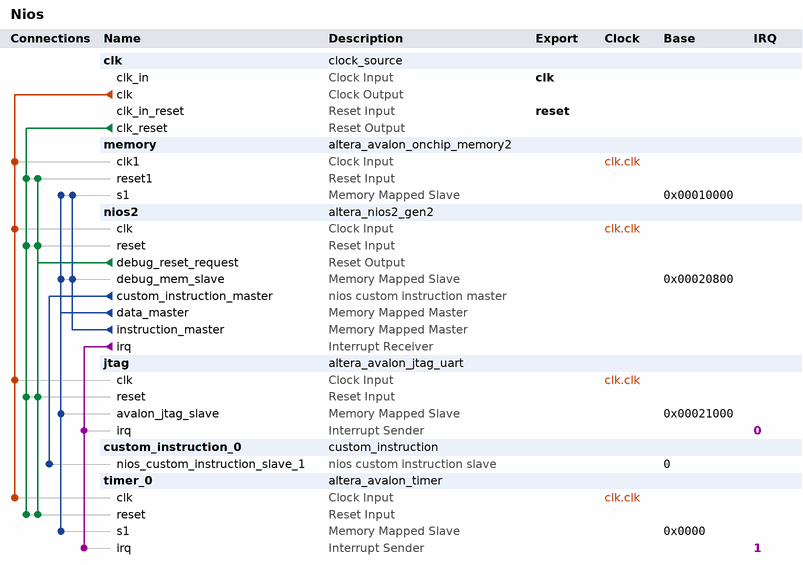
[diagram p0: system contents]
# Platform Designer (Qsys) system Nios, Cyclone V 5CSEMA5F31C6
# Parameters at their usual value, and those the tool derives, are not listed.
package require -exact qsys 18.1
create_system Nios
set_project_property DEVICE_FAMILY {Cyclone V}
set_project_property DEVICE 5CSEMA5F31C6

add_instance clk clock_source 18.1
set_instance_parameter_value clk clockFrequency 50000000

add_instance memory altera_avalon_onchip_memory2 18.1
set_instance_parameter_value memory dataWidth 32
set_instance_parameter_value memory dualPort false
set_instance_parameter_value memory initMemContent true
set_instance_parameter_value memory initializationFileName onchip_mem.hex
set_instance_parameter_value memory memorySize 40096

add_instance nios2 altera_nios2_gen2 18.1
set_instance_parameter_value nios2 dcache_size 2048
set_instance_parameter_value nios2 exceptionSlave memory.s1
set_instance_parameter_value nios2 icache_size 4096
set_instance_parameter_value nios2 impl Fast
set_instance_parameter_value nios2 resetSlave memory.s1

add_instance jtag altera_avalon_jtag_uart 18.1
set_instance_parameter_value jtag simInteractiveOptions NO_INTERACTIVE_WINDOWS

add_instance custom_instruction_0 custom_instruction 1.0

add_instance timer_0 altera_avalon_timer 18.1
set_instance_parameter_value timer_0 period 1
set_instance_parameter_value timer_0 periodUnits MSEC

# connections
add_connection clk.clk jtag.clk clock
add_connection clk.clk memory.clk1 clock
add_connection clk.clk nios2.clk clock
add_connection clk.clk timer_0.clk clock
add_connection clk.clk_reset jtag.reset reset
add_connection clk.clk_reset memory.reset1 reset
add_connection clk.clk_reset nios2.reset reset
add_connection clk.clk_reset timer_0.reset reset
add_connection nios2.debug_reset_request jtag.reset reset
add_connection nios2.debug_reset_request memory.reset1 reset
add_connection nios2.debug_reset_request nios2.reset reset
add_connection nios2.debug_reset_request timer_0.reset reset
add_connection nios2.data_master jtag.avalon_jtag_slave avalon
set_connection_parameter_value nios2.data_master/jtag.avalon_jtag_slave baseAddress 0x00021000
add_connection nios2.data_master memory.s1 avalon
set_connection_parameter_value nios2.data_master/memory.s1 baseAddress 0x00010000
add_connection nios2.data_master nios2.debug_mem_slave avalon
set_connection_parameter_value nios2.data_master/nios2.debug_mem_slave baseAddress 0x00020800
add_connection nios2.data_master timer_0.s1 avalon
set_connection_parameter_value nios2.data_master/timer_0.s1 baseAddress 0x0000
add_connection nios2.instruction_master memory.s1 avalon
set_connection_parameter_value nios2.instruction_master/memory.s1 baseAddress 0x00010000
add_connection nios2.instruction_master nios2.debug_mem_slave avalon
set_connection_parameter_value nios2.instruction_master/nios2.debug_mem_slave baseAddress 0x00020800
add_connection nios2.irq jtag.irq interrupt
set_connection_parameter_value nios2.irq/jtag.irq irqNumber 0
add_connection nios2.irq timer_0.irq interrupt
set_connection_parameter_value nios2.irq/timer_0.irq irqNumber 1
add_connection nios2.custom_instruction_master custom_instruction_0.nios_custom_instruction_slave_1 nios_custom_instruction
set_connection_parameter_value nios2.custom_instruction_master/custom_instruction_0.nios_custom_instruction_slave_1 CIName custom_instruction_0
set_connection_parameter_value nios2.custom_instruction_master/custom_instruction_0.nios_custom_instruction_slave_1 baseAddress 0

# exported interfaces
add_interface clk clock sink
set_interface_property clk EXPORT_OF clk.clk_in
add_interface reset reset sink
set_interface_property reset EXPORT_OF clk.clk_in_reset

set_interconnect_requirement {$system} qsys_mm.clockCrossingAdapter HANDSHAKE
set_interconnect_requirement {$system} qsys_mm.enableEccProtection FALSE
set_interconnect_requirement {$system} qsys_mm.insertDefaultSlave FALSE
set_interconnect_requirement {$system} qsys_mm.maxAdditionalLatency 1

save_system Nios.qsys
